# EAGLE schematic Arduino Board Simplified Schematic (EAGLE 8.7.0)
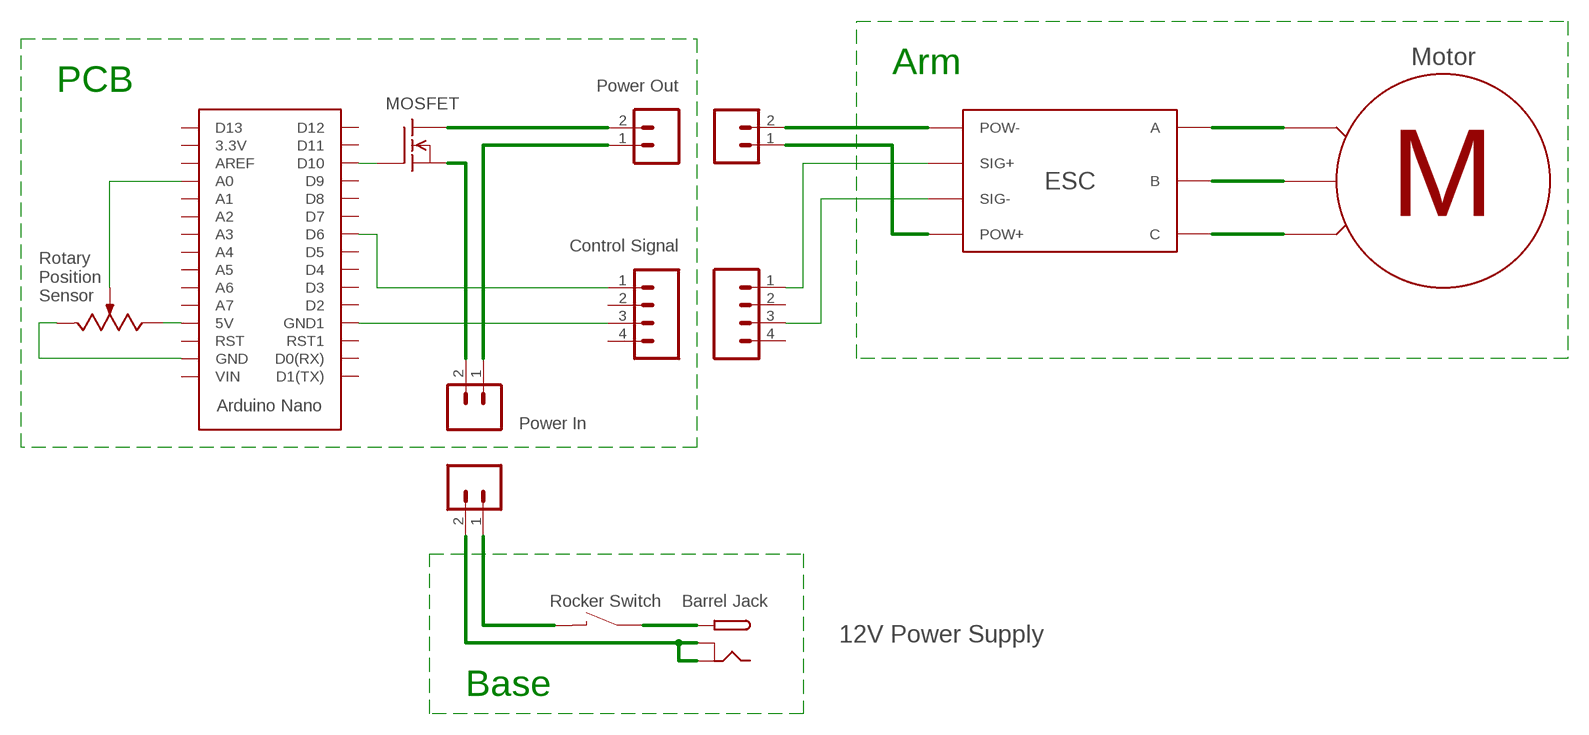
[diagram p0: schematic, sheet 1]

## Parts
ARDUINO_NANO  ARDUINO_NANO  [ARDUINO_NANO]
ESC  M04  [1X04]
ESC1  M04  [1X04]
MOSFET  N-CHANNEL_MOSFETGENERIC  [TO-220-SINK]
POWER_IN  M02  [1X02]
POWER_IN1  M02  [1X02]
POWER_OUT  M02  [1X02]
POWER_OUT1  M02  [1X02]
ROCKER_SWITCH1  46202LRX  [46202LRX]
ROTARY_SENSOR  10k  SV03  [SV03A]
U$1  ESC  (no package)
U$2  MOTOR_AC  (no package)
U$3  PJ-082BH  [PJ-082BH]

## Nets
5V: ARDUINO_NANO.5V ROTARY_SENSOR.3(A)
12V: POWER_IN.1 POWER_OUT.1
DRIVE: ARDUINO_NANO.D10 MOSFET.1(G)
ESC: ARDUINO_NANO.D6 ESC.1
N$1: MOSFET.3(S) POWER_IN.2
N$2: POWER_OUT1.1 U$1.POW+
N$3: MOSFET.2(D) POWER_OUT.2
N$4: ARDUINO_NANO.GND ROTARY_SENSOR.1(E)
N$5: ARDUINO_NANO.GND1 ESC.3
N$7: POWER_OUT1.2 U$1.POW-
N$8: ESC1.1 U$1.SIG+
N$9: ESC1.3 U$1.SIG-
N$10: U$1.A U$2.A
N$11: U$1.B U$2.B
N$12: U$1.C U$2.C
N$13: POWER_IN1.1 ROCKER_SWITCH1.P$2(B)
N$14: POWER_IN1.2 U$3.2(GND) U$3.SH1(SHIELD) U$3.SH2(SHIELD) U$3.SH3(SHIELD) U$3.SH4(SHIELD)
N$15: ROCKER_SWITCH1.P$1(A1) U$3.1(PWR)
SENSE: ARDUINO_NANO.A0 ROTARY_SENSOR.2(S) ROTARY_SENSOR.2.1(S)
Unconnected: ARDUINO_NANO.3.3V ARDUINO_NANO.A1 ARDUINO_NANO.A2 ARDUINO_NANO.A3 ARDUINO_NANO.A4 ARDUINO_NANO.A5 ARDUINO_NANO.A6 ARDUINO_NANO.A7 ARDUINO_NANO.AREF ARDUINO_NANO.D0(RX) ARDUINO_NANO.D1(TX) ARDUINO_NANO.D2 ARDUINO_NANO.D3 ARDUINO_NANO.D4 ARDUINO_NANO.D5 ARDUINO_NANO.D7 ARDUINO_NANO.D8 ARDUINO_NANO.D9 ARDUINO_NANO.D11 ARDUINO_NANO.D12 ARDUINO_NANO.D13 ARDUINO_NANO.RST ARDUINO_NANO.RST1 ARDUINO_NANO.VIN ESC1.2 ESC1.4 ESC.2 ESC.4

## Notes on the sheet
- Motor
- Arm
- PCB | Power Out
- ESC
- Rotary
  Position
  Sensor
- Control Signal
- Power In
- Rocker Switch | Barrel Jack
- 12V Power Supply
- Base

## Library data of the parts
ARDUINO_NANO = Controls Library:ARDUINO_NANO: Arduino Nano Device Specifications <https://www.arduino.cc/en/Main/ArduinoBoardNano> Pinout Diagram <http://pighixxx.com/nanopdf.pdf>
ESC ESC1 = Controls Library:M04: Standard 4-pin 0.1" header. NOTES ON THE VARIANTS LOCK and LOCK_LONGPADS... This footprint was designed to help hold the alignment of a through-hole component (i.e. 6-pin header) while soldering it into place. You may notice that each hole has been shifted either up or down by 0.005 of an inch from it's more standard position (which is a perfectly straight line). This slight alteration caused the pins (the squares in the middle) to touch the edges of the holes. Because they are alternating, it causes a "brace" to hold the component in place. 0.005 has proven to be the perfect amount of "off-center" position when using our standard breakaway headers. Although looks a little odd when you look at the bare footprint, once you have a header in there, the alteration is very hard to notice. Also,if you push a header all the way into place, it is covered up entirely on the bottom side. This idea of altering the position of holes to aid alignment will be further integrated into the Sparkfun Library for other footprints. It can help hold any component with 3 or more connection pins. Note: The Sparkfun version includes many other packages including surface mount that may be of future interest. Source: Sparkfun <https://github.com/sparkfun/SparkFun-Eagle-Libraries>
MOSFET = Controls Library:N-CHANNEL_MOSFET: Generic N-Channel MOSFET; _EXTERNAL_: 1
POWER_IN POWER_IN1 POWER_OUT POWER_OUT1 = Controls Library:M02: Standard 2-pin 0.1" header. NOTES ON THE VARIANTS LOCK and LOCK_LONGPADS... This footprint was designed to help hold the alignment of a through-hole component (i.e. 6-pin header) while soldering it into place. You may notice that each hole has been shifted either up or down by 0.005 of an inch from it's more standard position (which is a perfectly straight line). This slight alteration caused the pins (the squares in the middle) to touch the edges of the holes. Because they are alternating, it causes a "brace" to hold the component in place. 0.005 has proven to be the perfect amount of "off-center" position when using our standard breakaway headers. Although looks a little odd when you look at the bare footprint, once you have a header in there, the alteration is very hard to notice. Also,if you push a header all the way into place, it is covered up entirely on the bottom side. This idea of altering the position of holes to aid alignment will be further integrated into the Sparkfun Library for other footprints. It can help hold any component with 3 or more connection pins. Note: The Sparkfun version includes many other packages including surface mount that may be of future interest. Source: Sparkfun <https://github.com/sparkfun/SparkFun-Eagle-Libraries>
ROCKER_SWITCH1 = DC_LOAD_AU:46202LRX: 46202LRX Switch
ROTARY_SENSOR = Controls Library:SV03: Murata SV03 Series Rotary Position Sensor Total Resistance: 10 kOhms +/-30% Linearity: +/-2% Effective Rotational Angle: 333.3° Rated Voltage: 5V Datasheet <https://www.murata.com/~/media/webrenewal/support/library/catalog/products/sensor/rotaryposition/r51e.ashx>
U$1 = Controls Library:ESC
U$2 = Controls Library:MOTOR_AC: Generic three-phase AC electric motor
U$3 = Controls Library:PJ-082BH: CUI Inc. Shielded DC Power Jack 10 A Current Rating Datasheet <http://www.cui.com/product/resource/pj-082bh.pdf>